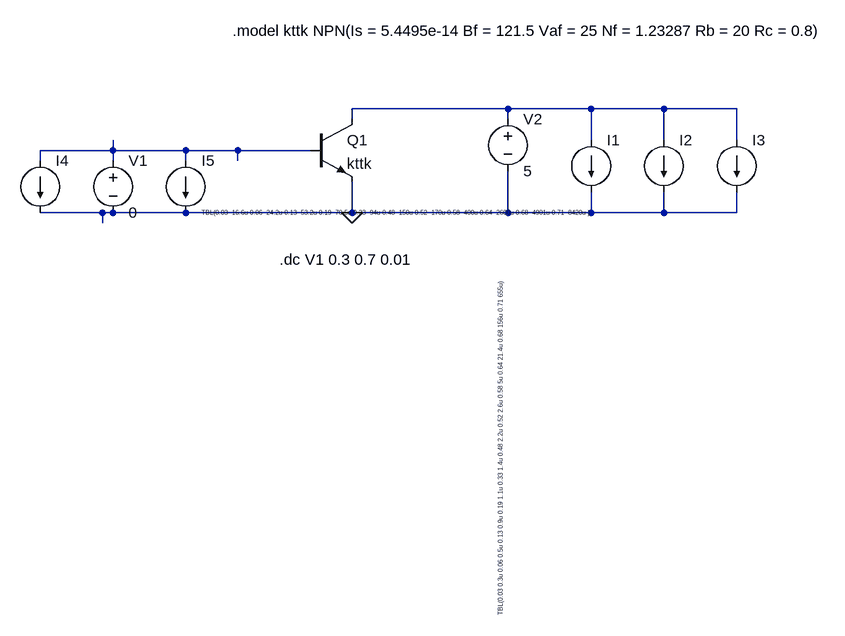
[diagram p0: schematic Draft1.asc]
Draft1.asc, the LTspice schematic file:
Version 4
SHEET 1 1568 900
WIRE 480 64 240 64
WIRE 608 64 480 64
WIRE 720 64 608 64
WIRE 832 64 720 64
WIRE 240 80 240 64
WIRE 480 80 480 64
WIRE 608 112 608 64
WIRE 720 112 720 64
WIRE 832 112 832 64
WIRE -128 128 -128 112
WIRE -128 128 -240 128
WIRE -16 128 -128 128
WIRE 64 128 -16 128
WIRE 176 128 64 128
WIRE -240 144 -240 128
WIRE -128 144 -128 128
WIRE -16 144 -16 128
WIRE 64 144 64 128
WIRE -144 224 -240 224
WIRE -128 224 -144 224
WIRE -16 224 -128 224
WIRE 240 224 240 176
WIRE 240 224 -16 224
WIRE 480 224 480 160
WIRE 480 224 240 224
WIRE 608 224 608 192
WIRE 608 224 480 224
WIRE 720 224 720 192
WIRE 720 224 608 224
WIRE 832 224 832 192
WIRE 832 224 720 224
WIRE -144 240 -144 224
FLAG 240 224 0
SYMBOL npn 176 80 R0
SYMATTR InstName Q1
SYMATTR Value kttk
SYMBOL voltage -128 128 R0
WINDOW 123 0 0 Left 0
WINDOW 39 0 0 Left 0
SYMATTR InstName V1
SYMATTR Value 0
SYMBOL voltage 480 64 R0
WINDOW 123 0 0 Left 0
WINDOW 39 0 0 Left 0
SYMATTR InstName V2
SYMATTR Value 5
SYMBOL current 608 112 R0
WINDOW 3 24 80 Invisible 0
WINDOW 123 0 0 Left 0
WINDOW 39 0 0 Left 0
SYMATTR Value TBL(0.02 0u 0.06 0.28u 0.09 0.73u 0.11 1.019u 0.15 1.69u 0.29 3.39u 0.69 3.76u 1 3.86u 1.2 3.9u 1.5 3.95u 1.75 4u 1.95 4.02u 2.23 4.08u 2.65 4.15u 3 4.19u 3.1 4.2u )
SYMATTR InstName I1
SYMBOL current 720 112 R0
WINDOW 3 24 80 Invisible 2
WINDOW 123 0 0 Left 0
WINDOW 39 0 0 Left 0
SYMATTR Value TBL(0.01 0u 0.05 0.28u 0.09 1.25u 0.28 6.15u 0.99 6.73u 1.74 6.93u )
SYMATTR InstName I2
SYMBOL current 832 112 R0
WINDOW 3 24 80 Invisible 2
WINDOW 123 0 0 Left 0
WINDOW 39 0 0 Left 0
SYMATTR Value TBL(0.01 0u 0.02 0.1124u 0.05 0.378u 0.08 1.5u 0.1 2.55u 0.13 4.16u 0.17 6.26u 0.19 7.32u 0.5 9.2u 0.58 9.25u 0.6 9.23u )
SYMATTR InstName I3
SYMBOL current -240 144 R0
WINDOW 3 709 700 VLeft 0
WINDOW 123 0 0 Left 0
WINDOW 39 0 0 Left 0
SYMATTR Value TBL(0.03 0.3u 0.06 0.5u 0.13 0.9u 0.19 1.1u 0.33 1.4u 0.48 2.2u 0.52 2.6u 0.58 5u 0.64 21.4u 0.68 156u 0.71 655u)
SYMATTR InstName I4
SYMBOL current -16 144 R0
WINDOW 3 24 80 Left 0
WINDOW 123 0 0 Left 0
WINDOW 39 0 0 Left 0
SYMATTR Value TBL(0.03  16.6u 0.06  24.2u 0.13  53.2u 0.19  70.5u 0.33  94u 0.48  150u 0.52  170u 0.58  400u 0.64  2600u 0.68  4901u 0.71  8420u )
SYMATTR InstName I5
TEXT 56 -56 Left 2 !.model kttk NPN(Is = 5.4495e-14 Bf = 121.5 Vaf = 25 Nf = 1.23287 Rb = 20 Rc = 0.8)
TEXT 128 296 Left 2 !.dc V1 0.3 0.7 0.01

The netlist it stands for:
* Draft1.asc
Q1 N001 N002 0 0 kttk
V1 N002 0 0
V2 N001 0 5
I1 N001 0 TBL(0.02 0u 0.06 0.28u 0.09 0.73u 0.11 1.019u 0.15 1.69u 0.29 3.39u 0.69 3.76u 1 3.86u 1.2 3.9u 1.5 3.95u 1.75 4u 1.95 4.02u 2.23 4.08u 2.65 4.15u 3 4.19u 3.1 4.2u )
I2 N001 0 TBL(0.01 0u 0.05 0.28u 0.09 1.25u 0.28 6.15u 0.99 6.73u 1.74 6.93u )
I3 N001 0 TBL(0.01 0u 0.02 0.1124u 0.05 0.378u 0.08 1.5u 0.1 2.55u 0.13 4.16u 0.17 6.26u 0.19 7.32u 0.5 9.2u 0.58 9.25u 0.6 9.23u )
I4 N002 0 TBL(0.03 0.3u 0.06 0.5u 0.13 0.9u 0.19 1.1u 0.33 1.4u 0.48 2.2u 0.52 2.6u 0.58 5u 0.64 21.4u 0.68 156u 0.71 655u)
I5 N002 0 TBL(0.03  16.6u 0.06  24.2u 0.13  53.2u 0.19  70.5u 0.33  94u 0.48  150u 0.52  170u 0.58  400u 0.64  2600u 0.68  4901u 0.71  8420u )
.model NPN NPN
.model PNP PNP
.lib standard.bjt
.model kttk NPN(Is = 5.4495e-14 Bf = 121.5 Vaf = 25 Nf = 1.23287 Rb = 20 Rc = 0.8)
.dc V1 0.3 0.7 0.01
.backanno
.end